# Altium schematic sheet sch_station_de_charge.SchDoc
size A3; SheetNumber: 1; SheetTotal: 2
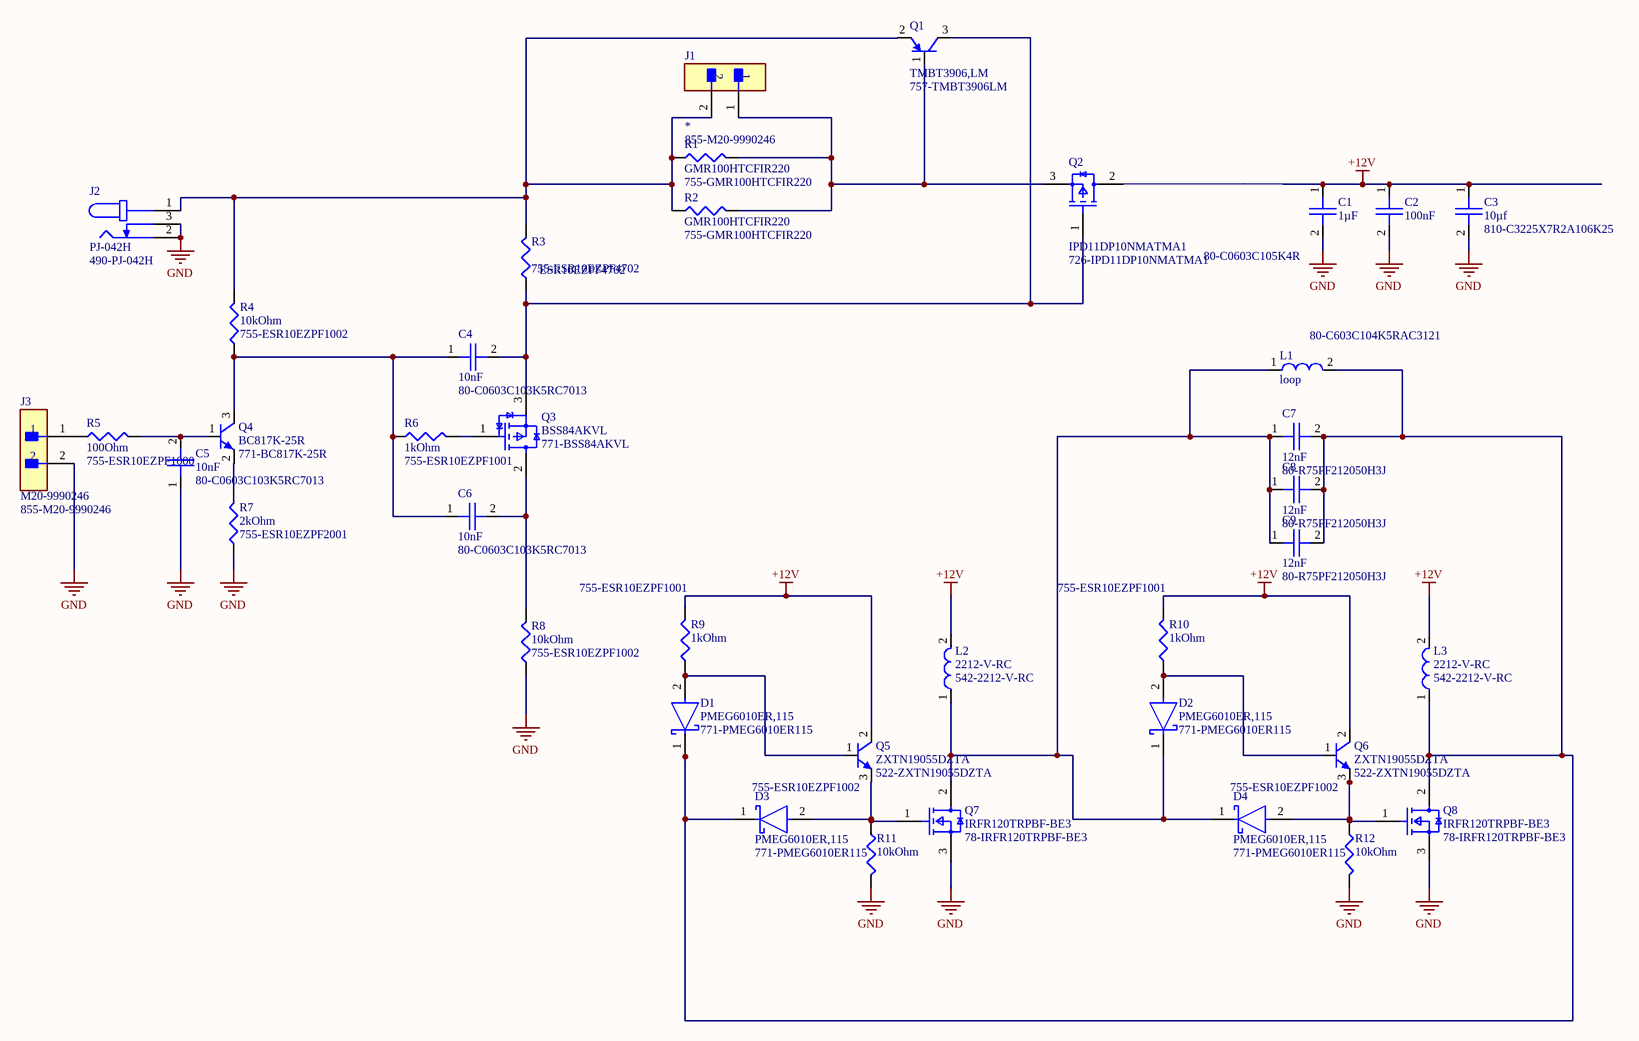
[diagram p0: sch_station_de_charge.SchDoc]

## Parts
C1  1µF  Supplier Part Number 1: 80-C0603C105K4R  [CAPC1608X90X35NL15T15]
C2  100nF  Supplier Part Number 1: 80-C603C104K5RAC3121  [FP-C0603C104K5RAC3121-IPC_A]
C3  10µf  Supplier Part Number 1: 810-C3225X7R2A106K25  [CAPC3225X280N]
C4  10nF  Supplier Part Number 1: 80-C0603C103K5RC7013  [FP-C0603C104K5RAC3121-IPC_A]
C5  10nF  Supplier Part Number 1: 80-C0603C103K5RC7013  [FP-C0603C104K5RAC3121-IPC_A]
C6  10nF  Supplier Part Number 1: 80-C0603C103K5RC7013  [FP-C0603C104K5RAC3121-IPC_A]
C7  12nF  Supplier Part Number 1: 80-R75PF212050H3J  [R75PF212050H3J]
C8  12nF  Supplier Part Number 1: 80-R75PF212050H3J  [R75PF212050H3J]
C9  12nF  Supplier Part Number 1: 80-R75PF212050H3J  [R75PF212050H3J]
D1  PMEG6010ER,115  Supplier Part Number 1: 771-PMEG6010ER115  [TVS_PTVS13VS1UR,115]
D2  PMEG6010ER,115  Supplier Part Number 1: 771-PMEG6010ER115  [TVS_PTVS13VS1UR,115]
D3  PMEG6010ER,115  Supplier Part Number 1: 771-PMEG6010ER115  [TVS_PTVS13VS1UR,115]
D4  PMEG6010ER,115  Supplier Part Number 1: 771-PMEG6010ER115  [TVS_PTVS13VS1UR,115]
J1  *  Supplier Part Number 1: 855-M20-9990246  [FP-M20-9990246-MFG]
J2  PJ-042H  Supplier Part Number 1: 490-PJ-042H  [CUI_PJ-042H]
J3  M20-9990246  Supplier Part Number 1: 855-M20-9990246  [FP-M20-9990246-MFG]
L1  loop  [loop]
L2  2212-V-RC  Supplier Part Number 1: 542-2212-V-RC  [IND_HCTI-220-5.8]
L3  2212-V-RC  Supplier Part Number 1: 542-2212-V-RC  [IND_HCTI-220-5.8]
Q1  TMBT3906,LM  Supplier Part Number 1: 757-TMBT3906LM  [FP-TMBT3906]
Q2  IPD11DP10NMATMA1  Supplier Part Number 1: 726-IPD11DP10NMATMA1  [FP-IPD11DP10NM]
Q3  BSS84AKVL  Supplier Part Number 1: 771-BSS84AKVL  [SOT95P230X110-3N]
Q4  BC817K-25R  Supplier Part Number 1: 771-BC817K-25R  [SOT95P230X110-3N]
Q5  ZXTN19055DZTA  Supplier Part Number 1: 522-ZXTN19055DZTA  [VREG_AP2204RA-3.3TRG1]
Q6  ZXTN19055DZTA  Supplier Part Number 1: 522-ZXTN19055DZTA  [VREG_AP2204RA-3.3TRG1]
Q7  IRFR120TRPBF-BE3  Supplier Part Number 1: 78-IRFR120TRPBF-BE3  [FP-IRFR120TRPBF-BE3]
Q8  IRFR120TRPBF-BE3  Supplier Part Number 1: 78-IRFR120TRPBF-BE3  [FP-IRFR120TRPBF-BE3]
R1  GMR100HTCFIR220  Supplier Part Number 1: 755-GMR100HTCFIR220  [RESC6432X55N]
R2  GMR100HTCFIR220  Supplier Part Number 1: 755-GMR100HTCFIR220  [RESC6432X55N]
R3  ESR10EZPF4702  Supplier Part Number 1: 755-ESR10EZPF4702  [FP-ESR10-IPC_A]
R4  10kOhm  Supplier Part Number 1: 755-ESR10EZPF1002  [FP-ESR10-IPC_A]
R5  100Ohm  Supplier Part Number 1: 755-ESR10EZPF1000  [FP-ESR10-IPC_A]
R6  1kOhm  Supplier Part Number 1: 755-ESR10EZPF1001  [FP-ESR10-IPC_A]
R7  2kOhm  Supplier Part Number 1: 755-ESR10EZPF2001  [FP-ESR10-IPC_A]
R8  10kOhm  Supplier Part Number 1: 755-ESR10EZPF1002  [FP-ESR10-IPC_A]
R9  1kOhm  Supplier Part Number 1: 755-ESR10EZPF1001  [FP-ESR10-IPC_A]
R10  1kOhm  Supplier Part Number 1: 755-ESR10EZPF1001  [FP-ESR10-IPC_A]
R11  10kOhm  Supplier Part Number 1: 755-ESR10EZPF1002  [FP-ESR10-IPC_A]
R12  10kOhm  Supplier Part Number 1: 755-ESR10EZPF1002  [FP-ESR10-IPC_A]

## Nets
+12V: C1.1 C2.1 C3.1 L2.2 L3.2 Q2.2(DRAIN) Q5.2(E) Q6.2(E) R9.2 R10.2
GND: C1.2 C2.2 C3.2 C5.1 J2.2 J2.3 J3.2 Q7.3(SOURCE) Q8.3(SOURCE) R7.1 R8.1 R11.2 R12.2
NetC4_1: C4.1 C6.1 Q4.3(C) R4.1 R6.1
NetC4_2: C4.2 Q1.3(C) Q2.1(GATE) Q3.3(SOURCE) R3.1
NetC5_2: C5.2 Q4.1(B) R5.2
NetC6_2: C6.2 Q3.2(DRAIN) R8.2
NetC7_1: C7.1 C8.1 C9.1 D2.1(C) D4.1(C) L1.1 L2.1 Q7.2(DRAIN)
NetC7_2: C7.2 C8.2 C9.2 D1.1(C) D3.1(C) L1.2 L3.1 Q8.2(DRAIN)
NetD1_2: D1.2(A) Q5.1(B) R9.1
NetD2_2: D2.2(A) Q6.1(B) R10.1
NetD3_2: D3.2(A) Q5.3(C) Q7.1(GATE) R11.1
NetD4_2: D4.2(A) Q6.3(C) Q8.1(GATE) R12.1
NetJ1_1: J1.1 Q1.1(B) Q2.3(SOURCE) R1.2 R2.2
NetJ1_2: J1.2 J2.1 Q1.2(E) R1.1 R2.1 R3.2 R4.2
NetJ3_1: J3.1 R5.1
NetQ3_1: Q3.1(GATE) R6.2
NetQ4_2: Q4.2(E) R7.2

## Library data of the parts
C1 = C0603C105K4RACTU: Cap Ceramic 1uF 16V X7R 10% SMD 0603 125°C Paper T/R; Manufacturer: KEMET; Dissipation Factor: 3.5%; Manufacturer Part Number: C0603C105K4RACTU; RoHS: Yes; Category: Ceramic Capacitors; Stock 1: 3280807; Pricing 1: 1=0,17000, 10=0,08000, 50=0,08000, 100=0,03600, 500=0,02600, 1000=0,02000, 2000=0,01900, 4000=0,01600, 8000=0,01400, 10000=0,01400 (USD); Mount: Surface Mount,PCB; Case/Package: 0603; Number of Pins: 2; Case Code (Metric): 1608; Case Code (Imperial): 0603; Contact Plating: Tin,Matte; Dielectric Material: Ceramic; Min Operating Temperature: -55°C; Max Operating Temperature: 125°C; Package Quantity: 4000; Capacitance: 1uF; Voltage Rating: 16V; Tolerance: 10%; Packaging: Tape and Reel; Voltage Rating (DC): 16V; Dielectric: X7R; Termination: SMD/SMT; Voltage: 16V; Series: C0603C; Construction: Flat; Length: 1.6mm; Width: 0.031inch; Height: 0.8mm; Thickness: 0.034inch; Depth: 0.8mm; Radiation Hardening: No; REACH SVHC: No SVHC; RoHS Compliant: Yes; ComponentLink1URL: https://datasheet.ciiva.com/7823/kem-c1002-x7r-smd-7823997.pdf?src-supplier=Element14; ComponentLink1Description: https://datasheet.ciiva.com/7823/kem-c1002-x7r-smd-7823997.pdf?src-supplier=Element14; ComponentLink2URL: https://datasheet.ciiva.com/22749/kem-c1002-x7r-smd-22749721.pdf?src-supplier=Element14; ComponentLink2Description: https://datasheet.ciiva.com/22749/kem-c1002-x7r-smd-22749721.pdf?src-supplier=Element14; ComponentLink3URL: https://datasheet.ciiva.com/5419/kem-c1002-x7r-smd-5419750.pdf?src-supplier=Mouser; ComponentLink3Description: https://datasheet.ciiva.com/5419/kem-c1002-x7r-smd-5419750.pdf?src-supplier=Mouser; ComponentLink4URL: https://datasheet.ciiva.com/18192/getdatasheetpartid-385479-18192732.pdf?src-supplier=Verical; ComponentLink4Description: https://datasheet.ciiva.com/18192/getdatasheetpartid-385479-18192732.pdf?src-supplier=Verical; Supplier 1: Mouser
C2 = C0603C104K5RAC3121: Cap Ceramic 0.1uF 50V X7R 10% Pad SMD 0603 125°C T/R; Manufacturer: KEMET; Manufacturer Part Number: C0603C104K5RAC3121; RoHS: Yes; Category: Ceramic Capacitors; Stock 1: 3306727; Pricing 1: 1=0,13000, 10=0,09200, 50=0,09200, 100=0,04300, 1000=0,02500, 10000=0,01900 (USD); Case/Package: 0603; RoHS Compliant: Yes; Supplier 1: Mouser
C3 = C3225X7R2A106K250AC: Multilayer Ceramic Chip Capacitors, Capacitance=10μF, LxWxT: 3.2x2.5x2.5mm; Manufacturer: TDK; Supplier 1: Mouser; Manufacturer Part Number: C3225X7R2A106K250AC; RoHS: No; Stock 1: 11549; Pricing 1: 1=1,50000, 10=1,19000, 50=1,19000, 100=0,89100, 1000=0,72000, 10000=0,72000 (USD)
C4-C6 = C0603C103K5RAC7013: Cap Ceramic 0.01uF 50V X7R 10% Pad SMD 0603 125C T/R; Manufacturer: KEMET; Supplier 1: Mouser; Manufacturer Part Number: C0603C103K5RAC7013; RoHS: Yes; Category: Ceramic Capacitors; Stock 1: 21368; Pricing 1: 1=0,13000, 10=0,05100, 50=0,05100, 100=0,04300, 500=0,03000, 1000=0,02500, 2000=0,02300, 4000=0,02000, 10000=0,02000 (USD); Mount: Surface Mount; Case/Package: 0603; Dielectric Material: Ceramic; Min Operating Temperature: -55°C; Max Operating Temperature: 125°C; Dielectric: X7R; Capacitance: 10nF; Tolerance: 10%; Voltage Rating (DC): 50V; Packaging: Tape and Reel; Package Quantity: 4000; Voltage Rating: 50V; Length: 1.6mm; Width: 0.031inch; Height: 0.8mm; Depth: 0.8mm; Thickness: 0.035inch; Radiation Hardening: No; ComponentLink1URL: http://components.arrow.com/part/dataview/5297356S5600630N7429?src-supplier=Arrow+Electronics; ComponentLink1Description: http://components.arrow.com/part/dataview/5297356S5600630N7429?src-supplier=Arrow+Electronics; ComponentLink2URL: https://www.distrelec.biz/Web/Downloads/_t/ds/KEM_C1002_X7R_SMD_eng_tds.pdf?mime=application%2Fpdf&src-supplier=Distrelec; ComponentLink2Description: https://www.distrelec.biz/Web/Downloads/_t/ds/KEM_C1002_X7R_SMD_eng_tds.pdf?mime=application%2Fpdf&src-supplier=Distrelec; ComponentLink3URL: https://api.kemet.com/component-edge/download/datasheet/C0603C103K5RAC7013.pdf?src-supplier=Digi-Key; ComponentLink3Description: https://api.kemet.com/component-edge/download/datasheet/C0603C103K5RAC7013.pdf?src-supplier=Digi-Key
C7-C9 = R75PF212050H3J: Cap Film 0.012uF 630V PP 5% Molded Solder Pin 10mm 125°C Bulk; Manufacturer: KEMET; Supplier 1: Mouser; Manufacturer Part Number: R75PF212050H3J; RoHS: Yes; Category: Film Capacitors; Stock 1: 3328; Pricing 1: 1=0,55000, 10=0,39100, 50=0,29600, 100=0,25700, 1000=0,16200, 10000=0,15200 (USD)
D1-D4 = PMEG6010ER,115: DIODE SCHOTTKY 60V 1A SOD123W; Manufacturer: Nexperia; Supplier 1: Mouser; Manufacturer Part Number: PMEG6010ER,115; RoHS: Yes; Category: Rectifier Diodes; Stock 1: 80739; Pricing 1: 1=0,44000, 10=0,33300, 50=0,33300, 100=0,20700, 500=0,14200, 1000=0,10900, 3000=0,09200, 9000=0,08400, 10000=0,08400, 24000=0,07800, 45000=0,07600 (USD); RoHS Compliant: Yes; ComponentLink1URL: http://www.farnell.com/datasheets/1383349.pdf?src-supplier=Farnell; ComponentLink1Description: http://www.farnell.com/datasheets/1383349.pdf?src-supplier=Farnell; ComponentLink2URL: https://assets.nexperia.com/documents/data-sheet/PMEG6010ER.pdf?src-supplier=Digi-Key; ComponentLink2Description: https://assets.nexperia.com/documents/data-sheet/PMEG6010ER.pdf?src-supplier=Digi-Key
J1 J3 = M20-9990246: 2.54mm (0.1") Pitch SIL Vertical PC Tail Pin Header, 6.1mm mating pin height, tin, 2 contacts; Manufacturer: Harwin; Number of Contacts: 2; Current Rating: 3A; Contact Resistance: 30mR; Gender: Male; Insulation Resistance: 10GR; Voltage Rating (AC): 750V; Connector Type: Male Pin; Supplier 1: Mouser; Manufacturer Part Number: M20-9990246; RoHS: Yes; Category: Headers and Wire Housings; Stock 1: 121083; Pricing 1: 1=0,17000, 10=0,08400, 50=0,08400, 100=0,07000, 500=0,06300, 1000=0,05400, 2000=0,04600, 10000=0,04500, 25000=0,03700, 50000=0,03500 (USD); Mount: Through Hole; Case/Package: SIL; Contact Plating: Tin; Color: Black; Contact Material: Brass,Bronze; Housing Color: Black; Housing Material: Nylon; Min Operating Temperature: -40°C; Max Operating Temperature: 105°C; Number of Rows: 1; Termination: Solder; Package Quantity: 1000; Packaging: Bulk; Max Current Rating: 3A; Number of Positions: 2; Orientation: Straight; Length: 5.08mm; Pitch: 2.54mm; Contact Mating Length: 0.24inch; Depth: 2.54mm; Radiation Hardening: No; REACH SVHC: No SVHC; ComponentLink1URL: https://datasheet.ciiva.com/8046/315376-8046930.pdf?src-supplier=Element14; ComponentLink1Description: https://datasheet.ciiva.com/8046/315376-8046930.pdf?src-supplier=Element14; ComponentLink2URL: https://datasheet.ciiva.com/11745/0900766b81034e61-11745755.pdf?src-supplier=RSComponents; ComponentLink2Description: https://datasheet.ciiva.com/11745/0900766b81034e61-11745755.pdf?src-supplier=RSComponents; ComponentLink3URL: https://datasheet.ciiva.com/22660/1830818-22660571.pdf?src-supplier=Element14; ComponentLink3Description: https://datasheet.ciiva.com/22660/1830818-22660571.pdf?src-supplier=Element14; ComponentLink4URL: https://datasheet.ciiva.com/6833/m20-999-6833368.pdf?src-supplier=Digi-Key; ComponentLink4Description: https://datasheet.ciiva.com/6833/m20-999-6833368.pdf?src-supplier=Digi-Key; ComponentLink5URL: https://datasheet.ciiva.com/26852/getdatasheetpartid-384170-26852203.pdf?src-supplier=Verical; ComponentLink5Description: https://datasheet.ciiva.com/26852/getdatasheetpartid-384170-26852203.pdf?src-supplier=Verical
J2 = PJ-042H: 1.65 x 5.15 mm, 5.0 A, Horizontal, Through Hole, Kinked Pins, Dc Power Jack Connector; Manufacturer: CUI Devices; Supplier 1: Mouser; Manufacturer Part Number: PJ-042H; RoHS: Yes; Category: Power Connectors; Stock 1: 5617; Pricing 1: 1=0,75000, 10=0,59500, 50=0,59500, 100=0,51800, 1000=0,41400, 10000=0,37000 (USD)
L2 L3 = 2212-V-RC: Inductor High Current Toroid 100uH/64uH 15% 1KHz 4.4A 56mOhm DCR RDL; Manufacturer: Bourns JW Miller; Core Material: Ferrite; Lead/Base Style: Radial; Inductance: 100uH; Shielding: Shielded; DC Resistance (DCR): 56mR; Lead Diameter: 0.86mm; Supplier 1: Mouser; Manufacturer Part Number: 2212-V-RC; RoHS: Yes; Category: Fixed Inductors; Stock 1: 1501; Pricing 1: 1=4,88000, 10=4,48000, 50=3,72000, 100=2,93000, 1000=2,93000, 10000=2,93000 (USD); Mount: Through Hole,Radial; Case/Package: Radial; Number of Pins: 2; Contact Plating: Tin; Min Operating Temperature: -55°C; Max Operating Temperature: 105°C; Tolerance: 15%; Test Frequency: 1kHz; Inductance Tolerance: 15%; Current Rating: 4.4A; Package Quantity: 77; Packaging: Bulk; Max DC Current: 4.4A; Termination: Radial; DC Current: 4.4A; RMS Current (Irms): 4.4A; Series: 2200; Diameter: 0.95inch; Width: 0.55inch; Lead Pitch: 11.176mm; Height - Seated (Max): 0.55inch; Depth: 13.97mm; Radiation Hardening: No; REACH SVHC: No SVHC; Military Standard: Not; Lead Free: Lead Free; RoHS Compliant: Yes; ComponentLink1URL: https://datasheet.ciiva.com/11798/0900766b80fa5688-11798051.pdf?src-supplier=RSComponents; ComponentLink1Description: https://datasheet.ciiva.com/11798/0900766b80fa5688-11798051.pdf?src-supplier=RSComponents; ComponentLink2URL: https://datasheet.ciiva.com/6690/2200-series-6690646.pdf?src-supplier=Digi-Key; ComponentLink2Description: https://datasheet.ciiva.com/6690/2200-series-6690646.pdf?src-supplier=Digi-Key; ComponentLink3URL: https://datasheet.ciiva.com/28654/2200-series-28654982.pdf?src-supplier=Element14; ComponentLink3Description: https://datasheet.ciiva.com/28654/2200-series-28654982.pdf?src-supplier=Element14; ComponentLink4URL: https://datasheet.ciiva.com/3076/2200-series-3076522.pdf?src-supplier=Avnet; ComponentLink4Description: https://datasheet.ciiva.com/3076/2200-series-3076522.pdf?src-supplier=Avnet
Q1 = TMBT3906,LM: TRANSPNP50V0.15ASOT23-3; Manufacturer: Toshiba; Max Collector Current: 150mA; Collector Emitter Voltage (VCEO): 400mV; Max Power Dissipation: 320mW; Transition Frequency: 250MHz; Collector Emitter Breakdown Voltage: 50V; Supplier 1: Mouser; Manufacturer Part Number: TMBT3906,LM; RoHS: Yes; Category: BJTs; Stock 1: 7851; Pricing 1: 1=0,18000, 10=0,16800, 50=0,16800, 100=0,09100, 500=0,05600, 1000=0,03900, 3000=0,02900, 9000=0,02500, 10000=0,02500, 24000=0,02200, 45000=0,01900 (USD); Mount: Surface Mount; Case/Package: TO-236-3; Packaging: Tape and Reel; Max Breakdown Voltage: 50V; ComponentLink1URL: http://www.mouser.com/ds/2/408/TMBT3906_datasheet_en_20150108-736658.pdf?src-supplier=Mouser; ComponentLink1Description: http://www.mouser.com/ds/2/408/TMBT3906_datasheet_en_20150108-736658.pdf?src-supplier=Mouser; ComponentLink2URL: https://toshiba.semicon-storage.com/info/docget.jsp?did=29746&prodName=TMBT3906&src-supplier=Digi-Key; ComponentLink2Description: https://toshiba.semicon-storage.com/info/docget.jsp?did=29746&prodName=TMBT3906&src-supplier=Digi-Key
Q2 = IPD11DP10NMATMA1: Mosfet, P-ch, 100V, TO-252-3 Rohs Compliant: Yes; Manufacturer: Infineon; Supplier 1: Mouser; Manufacturer Part Number: IPD11DP10NMATMA1; RoHS: No; Category: Uncategorized; Stock 1: 2351; Pricing 1: 1=2,01000, 10=1,81000, 50=1,81000, 100=1,46000, 1000=1,14000, 10000=1,13000 (USD)
Q3 = BSS84AKVL: BSS84AKV/SOT666/SOT6; Manufacturer: Nexperia; Supplier 1: Mouser; Manufacturer Part Number: BSS84AKVL; RoHS: Yes; Stock 1: 4944; Pricing 1: 1=0,24000, 10=0,20200, 50=0,20200, 100=0,10800, 500=0,07100, 1000=0,04800, 2500=0,03800, 10000=0,03100 (USD); RoHS Compliant: Yes
Q4 = BC817K-25R: BC817K-25H/SOT23/TO-236AB; Manufacturer: Nexperia; Supplier 1: Mouser; Manufacturer Part Number: BC817K-25R; RoHS: No; Category: BJTs; Stock 1: 50401; Pricing 1: 1=0,24000, 10=0,19900, 50=0,19900, 100=0,10600, 1000=0,04800, 10000=0,03100 (USD); RoHS Compliant: Yes
Q5 Q6 = ZXTN19055DZTA: TRANS NPN 55V 6A SOT89; Manufacturer: Diodes Zetex; Max Power Dissipation: 2.1W; Transition Frequency: 200MHz; Collector Base Voltage (VCBO): 150V; Emitter Base Voltage (VEBO): 7V; Element Configuration: Single; Number of Elements: 1; Collector-emitter Voltage-Max: 250mV; Supplier 1: Mouser; Manufacturer Part Number: ZXTN19055DZTA; RoHS: Yes; Category: BJTs; Stock 1: 6672; Pricing 1: 1=0,73000, 10=0,64800, 50=0,64800, 100=0,49700, 1000=0,31300, 10000=0,26500 (USD); Mount: Surface Mount; Case/Package: SOT-89; Number of Pins: 4; Weight: 0.001834oz; Min Operating Temperature: -55°C; Max Operating Temperature: 150°C; Packaging: Tape and Reel; Package Quantity: 1000; Collector Emitter Voltage (VCEO): 55V; Max Collector Current: 6A; Polarity: NPN; Collector Emitter Breakdown Voltage: 55V; Gain Bandwidth Product: 200MHz; Frequency: 200MHz; Power Dissipation: 2.1W; Voltage Rating (DC): 55V; Current Rating: 6A; Series: -; Length: 4.6mm; Width: 2.6mm; Height: 1.6mm; Radiation Hardening: No; REACH SVHC: No SVHC; Lead Free: Lead Free; RoHS Compliant: Yes; ComponentLink1URL: https://datasheet.ciiva.com/11207/zxtn19055dz-11207305.pdf?src-supplier=Avnet; ComponentLink1Description: https://datasheet.ciiva.com/11207/zxtn19055dz-11207305.pdf?src-supplier=Avnet; ComponentLink2URL: https://datasheet.ciiva.com/6359/zxtn19055dz-6359881.pdf?src-supplier=Digi-Key; ComponentLink2Description: https://datasheet.ciiva.com/6359/zxtn19055dz-6359881.pdf?src-supplier=Digi-Key; ComponentLink3URL: https://datasheet.ciiva.com/6359/zxtn19055dz-6359879.pdf?src-supplier=Digi-Key; ComponentLink3Description: https://datasheet.ciiva.com/6359/zxtn19055dz-6359879.pdf?src-supplier=Digi-Key; Max Breakdown Voltage: 55V; Collector Emitter Saturation Voltage: 250mV; Max Frequency: 200MHz
Q7 Q8 = IRFR120TRPBF-BE3: Manufacturer: Vishay Siliconix; Supplier 1: Mouser; Manufacturer Part Number: IRFR120TRPBF-BE3; RoHS: Yes; Stock 1: 3186; Pricing 1: 1=1,41000, 10=1,27000, 50=1,27000, 100=0,98800, 500=0,81600, 1000=0,64400, 2000=0,60400, 10000=0,60400 (USD)
R1 R2 = GMR100HTCFIR220: Res Current Sense Metal Plate 2512 0.1 Ohm 1% 3W ±20ppm/°C Molded Emboss T/R; Manufacturer: Rohm; Resistance: 220mR; Supplier 1: Mouser; Manufacturer Part Number: GMR100HTCFIR220; RoHS: No; Category: Chip SMD Resistors; Stock 1: 10040; Pricing 1: 1=1,30000, 10=1,16000, 50=1,05000, 100=1,05000, 1000=1,05000, 10000=1,05000 (USD); Case/Package: 2512; Case Code (Imperial): 2512; Case Code (Metric): 6432; Min Operating Temperature: -55°C; Max Operating Temperature: 170°C; Resistor Type: Metal Element; Features: Automotive AEC-Q200; Packaging: Tape and Reel; Tolerance: 1%; Max Power Dissipation: 3W; Temperature Coefficient: 20ppm/°C; Number of Terminations: 2; ComponentLink1URL: http://www.farnell.com/datasheets/2372626.pdf?src-supplier=Farnell; ComponentLink1Description: http://www.farnell.com/datasheets/2372626.pdf?src-supplier=Farnell; ComponentLink2URL: http://rohmfs.rohm.com/en/products/databook/datasheet/passive/resistor/chip_resistor/gmr-e.pdf?src-supplier=Digi-Key; ComponentLink2Description: http://rohmfs.rohm.com/en/products/databook/datasheet/passive/resistor/chip_resistor/gmr-e.pdf?src-supplier=Digi-Key; ComponentLink3URL: http://www.farnell.com/datasheets/2372626.pdf?src-supplier=Newark; ComponentLink3Description: http://www.farnell.com/datasheets/2372626.pdf?src-supplier=Newark
R3 = ESR10EZPF4702: Res Thick Film 0805 47K Ohm 1% 0.4W ±100ppm/C Pad SMD Automotive T/R; Manufacturer: Rohm; Resistance: 47kR; Temperature Coefficient: 100ppm/°C; Max Power Dissipation: 400mW; Supplier 1: Mouser; Manufacturer Part Number: ESR10EZPF4702; RoHS: Yes; Category: Chip SMD Resistors; Stock 1: 31570; Pricing 1: 1=0,18000, 10=0,15300, 50=0,15300, 100=0,06000, 1000=0,02600, 2500=0,02300, 5000=0,02000, 10000=0,02000 (USD); Case/Package: 0805; Case Code (Metric): 2012; Case Code (Imperial): 0805; Min Operating Temperature: -55°C; Max Operating Temperature: 155°C; Tolerance: 1%; Packaging: Tape and Reel; Resistor Type: Thick Film; Package Quantity: 1; Number of Terminations: 2; Features: Automotive AEC-Q200; Series: ESR; Length: 0.079inch; Width: 0.049inch; Height: 0.026inch; RoHS Compliant: Yes; ComponentLink1URL: https://datasheet.ciiva.com/2469/esr-2469981.pdf?src-supplier=Digi-Key; ComponentLink1Description: https://datasheet.ciiva.com/2469/esr-2469981.pdf?src-supplier=Digi-Key; ComponentLink2URL: https://datasheet.ciiva.com/2469/esr-2469979.pdf?src-supplier=Digi-Key; ComponentLink2Description: https://datasheet.ciiva.com/2469/esr-2469979.pdf?src-supplier=Digi-Key; ComponentLink3URL: https://datasheet.ciiva.com/2469/esr-2469980.pdf?src-supplier=Digi-Key; ComponentLink3Description: https://datasheet.ciiva.com/2469/esr-2469980.pdf?src-supplier=Digi-Key
R4 R8 R11 R12 = ESR10EZPF1002: Res Thick Film 0805 10K Ohm 1% 0.4W ±100ppm/C Pad SMD Automotive T/R; Manufacturer: Rohm; Resistance: 10kR; Max Power Dissipation: 400mW; Temperature Coefficient: 100ppm/°C; Manufacturer Part Number: ESR10EZPF1002; RoHS: Yes; Category: Chip SMD Resistors; Stock 1: 82018; Pricing 1: 1=0,18000, 10=0,15300, 50=0,15300, 100=0,06000, 1000=0,02600, 2500=0,02300, 5000=0,02000, 10000=0,02000 (USD); Case/Package: 0805; Case Code (Metric): 2012; Case Code (Imperial): 0805; Min Operating Temperature: -55°C; Max Operating Temperature: 155°C; Package Quantity: 1; Tolerance: 1%; Packaging: Tape and Reel; Resistor Type: Thick Film; Number of Terminations: 2; Features: Automotive AEC-Q200; Series: ESR; Length: 0.079inch; Width: 0.049inch; Height: 0.026inch; RoHS Compliant: Yes; ComponentLink1URL: https://datasheet.ciiva.com/2469/esr-2469862.pdf?src-supplier=Digi-Key; ComponentLink1Description: https://datasheet.ciiva.com/2469/esr-2469862.pdf?src-supplier=Digi-Key; ComponentLink2URL: https://datasheet.ciiva.com/2469/esr-2469863.pdf?src-supplier=Digi-Key; ComponentLink2Description: https://datasheet.ciiva.com/2469/esr-2469863.pdf?src-supplier=Digi-Key; ComponentLink3URL: https://datasheet.ciiva.com/2469/esr-2469864.pdf?src-supplier=Digi-Key; ComponentLink3Description: https://datasheet.ciiva.com/2469/esr-2469864.pdf?src-supplier=Digi-Key; Supplier 1: Mouser
R5 = ESR10EZPF1000: Res Thick Film 0805 100 Ohm 1% 2/5W ±100ppm/°C Molded SMD Paper T/R; Manufacturer: Rohm; Resistance: 100R; Max Power Dissipation: 400mW; Manufacturer Part Number: ESR10EZPF1000; RoHS: Yes; Category: Chip SMD Resistors; Stock 1: 17116; Pricing 1: 1=0,18000, 10=0,15300, 50=0,15300, 100=0,06000, 1000=0,02600, 10000=0,02000 (USD); Case/Package: 0805; Case Code (Imperial): 0805; Case Code (Metric): 2012; Min Operating Temperature: -55°C; Max Operating Temperature: 155°C; Resistor Type: Thick Film; Packaging: Tape and Reel; Tolerance: 1%; Temperature Coefficient: 100ppm/°C; Features: Automotive AEC-Q200; Number of Terminations: 2; Series: ESR; RoHS Compliant: Yes; ComponentLink1URL: http://www.farnell.com/datasheets/2611941.pdf?src-supplier=Farnell; ComponentLink1Description: http://www.farnell.com/datasheets/2611941.pdf?src-supplier=Farnell; ComponentLink2URL: https://www.rohm.com/datasheet/ESR01MZPF/esr-e?src-supplier=Digi-Key; ComponentLink2Description: https://www.rohm.com/datasheet/ESR01MZPF/esr-e?src-supplier=Digi-Key; ComponentLink3URL: http://www.farnell.com/datasheets/2611941.pdf?src-supplier=Newark; ComponentLink3Description: http://www.farnell.com/datasheets/2611941.pdf?src-supplier=Newark; ComponentLink4URL: http://rohmfs.rohm.com/en/products/databook/datasheet/passive/resistor/chip_resistor/esr.pdf?src-supplier=Avnet; ComponentLink4Description: http://rohmfs.rohm.com/en/products/databook/datasheet/passive/resistor/chip_resistor/esr.pdf?src-supplier=Avnet; Supplier 1: Mouser
R6 R9 R10 = ESR10EZPF1001: Res Thick Film 0805 1K Ohm 1% 0.4W ±100ppm/C Epoxy Resin Pad SMD Automotive T/R; Manufacturer: Rohm; Resistance: 1kR; Temperature Coefficient: 100ppm/°C; Power Rating: 400mW; Manufacturer Part Number: ESR10EZPF1001; RoHS: Yes; Category: Chip SMD Resistors; Stock 1: 27313; Pricing 1: 1=0,18000, 10=0,15300, 50=0,15300, 100=0,06000, 1000=0,02600, 10000=0,02000 (USD); Case/Package: 0805; Case Code (Metric): 2012; Case Code (Imperial): 0805; Size Code: 0805; Min Operating Temperature: -55°C; Max Operating Temperature: 155°C; Tolerance: 1%; Packaging: Tape and Reel; Resistor Type: Thick Film; Package Quantity: 1; Number of Terminations: 2; Max Power Dissipation: 400mW; Features: Automotive AEC-Q200; Series: ESR; Length: 0.079inch; Width: 0.049inch; Height: 0.026inch; Lead Free: Lead Free; RoHS Compliant: Yes; ComponentLink1URL: https://datasheet.ciiva.com/2470/esr-2470004.pdf?src-supplier=Digi-Key; ComponentLink1Description: https://datasheet.ciiva.com/2470/esr-2470004.pdf?src-supplier=Digi-Key; ComponentLink2URL: https://datasheet.ciiva.com/2470/esr-2470005.pdf?src-supplier=Digi-Key; ComponentLink2Description: https://datasheet.ciiva.com/2470/esr-2470005.pdf?src-supplier=Digi-Key; ComponentLink3URL: https://datasheet.ciiva.com/2470/esr-2470003.pdf?src-supplier=Digi-Key; ComponentLink3Description: https://datasheet.ciiva.com/2470/esr-2470003.pdf?src-supplier=Digi-Key; Supplier 1: Mouser
R7 = ESR10EZPF2001: Res Thick Film 0805 2K Ohm 1% 2/5W ±100ppm/°C Molded SMD Paper T/R; Manufacturer: Rohm; Resistance: 2kR; Power Rating: 400mW; Supplier 1: Mouser; Manufacturer Part Number: ESR10EZPF2001; RoHS: Yes; Category: Chip SMD Resistors; Stock 1: 82201; Pricing 1: 1=0,18000, 10=0,15300, 50=0,15300, 100=0,06000, 1000=0,02600, 10000=0,02000 (USD); Case/Package: 0805; Case Code (Metric): 2012; Case Code (Imperial): 0805; Size Code: 0805; Tolerance: 1%; Packaging: Tape and Reel; Resistor Type: Thick Film; Temperature Coefficient: 100ppm/°C; Package Quantity: 5000; Number of Terminations: 2; Max Power Dissipation: 400mW; Series: ESR10; Length: 0.079inch; Width: 0.049inch; Height: 0.026inch; Lead Free: Lead Free; RoHS Compliant: Yes; ComponentLink1URL: http://www1.futureelectronics.com/doc/ROHM%20SEMICONDUCTOR/ESR10EZPD.pdf?src-supplier=Future+Electronics; ComponentLink1Description: http://www1.futureelectronics.com/doc/ROHM%20SEMICONDUCTOR/ESR10EZPD.pdf?src-supplier=Future+Electronics; ComponentLink2URL: https://www.rohm.com/datasheet/ESR01MZPF/esr-e?src-supplier=Digi-Key; ComponentLink2Description: https://www.rohm.com/datasheet/ESR01MZPF/esr-e?src-supplier=Digi-Key; ComponentLink3URL: http://www.rohm.com/web/global/datasheet/ESR01MZPF/esr-e?src-supplier=Digi-Key; ComponentLink3Description: http://www.rohm.com/web/global/datasheet/ESR01MZPF/esr-e?src-supplier=Digi-Key; ComponentLink4URL: http://rohmfs.rohm.com/en/products/databook/datasheet/passive/resistor/chip_resistor/esr.pdf?src-supplier=Avnet; ComponentLink4Description: http://rohmfs.rohm.com/en/products/databook/datasheet/passive/resistor/chip_resistor/esr.pdf?src-supplier=Avnet